# EAGLE design Shield H-Bridge v1.716 (EAGLE 7.2.0)
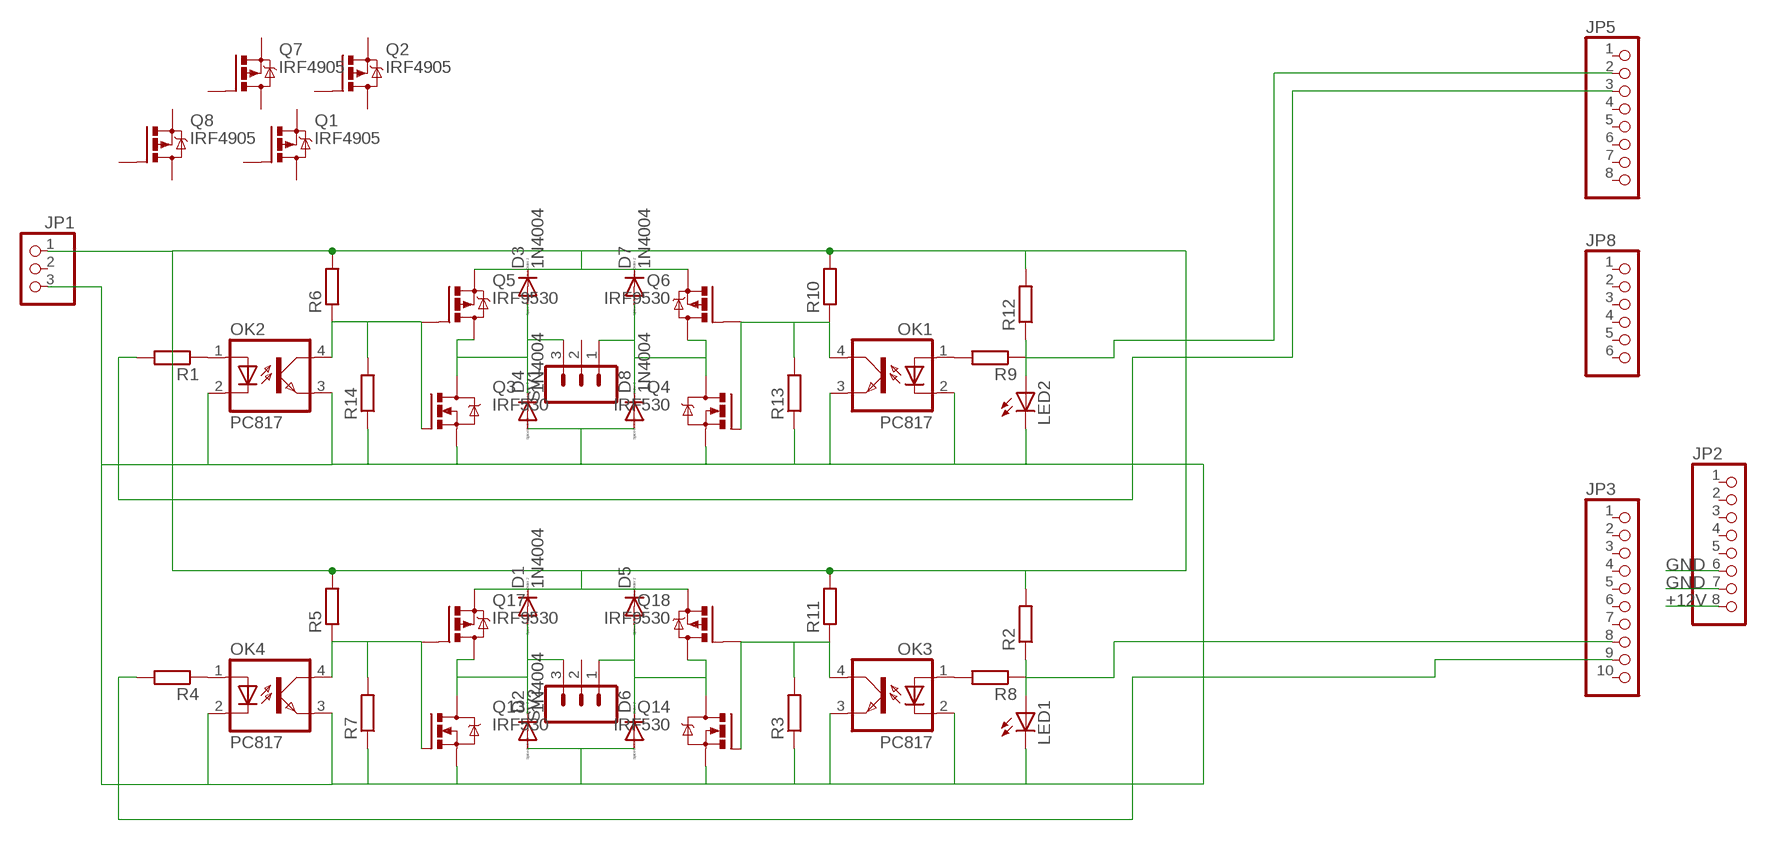
[diagram p0: schematic, sheet 1]

## Parts
D1  1N4004  [DO41-10]
D2  1N4004  [DO41-10]
D3  1N4004  [DO41-10]
D4  1N4004  [DO41-10]
D5  1N4004  [DO41-10]
D6  1N4004  [DO41-10]
D7  1N4004  [DO41-10]
D8  1N4004  [DO41-10]
JP1  PINHD-1X3  [1X03]
JP2  PINHD-1X8  [1X08]
JP3  PINHD-1X10  [1X10]
JP5  PINHD-1X8  [1X08]
JP8  PINHD-1X6  [1X06]
LED1  LED3MM  [LED3MM]
LED2  LED3MM  [LED3MM]
OK1  PC817  [DIL04]
OK2  PC817  [DIL04]
OK3  PC817  [DIL04]
OK4  PC817  [DIL04]
Q1  IRF4905  [TO220BH]
Q2  IRF4905  [TO220BH]
Q3  IRF530  [TO220BV]
Q4  IRF530  [TO220BV]
Q5  IRF9530  [TO220BV]
Q6  IRF9530  [TO220BV]
Q7  IRF4905  [TO220BH]
Q8  IRF4905  [TO220BH]
Q13  IRF530  [TO220BV]
Q14  IRF530  [TO220BV]
Q17  IRF9530  [TO220BV]
Q18  IRF9530  [TO220BV]
R1  R-EU_0204/7  [0204/7]
R2  R-EU_0204/5  [0204/5]
R3  R-EU_0204/7  [0204/7]
R4  R-EU_0204/7  [0204/7]
R5  R-EU_0204/7  [0204/7]
R6  R-EU_0204/7  [0204/7]
R7  R-EU_0204/7  [0204/7]
R8  R-EU_0204/7  [0204/7]
R9  R-EU_0204/7  [0204/7]
R10  R-EU_0204/7  [0204/7]
R11  R-EU_0204/7  [0204/7]
R12  R-EU_0204/5  [0204/5]
R13  R-EU_0204/7  [0204/7]
R14  R-EU_0204/7  [0204/7]
SV1  MA03-1  [MA03-1]
SV2  MA03-1  [MA03-1]

## Nets
+12V: D1.C D3.C D5.C D7.C JP1.1 JP2.8 Q5.S Q6.S Q17.S Q18.S R2.2 R5.2 R6.2 R10.2 R11.2 R12.2
GND: D2.A D4.A D6.A D8.A JP1.3 JP2.6 JP2.7 LED1.K(C) LED2.K(C) OK1.2(C) OK1.3(EMIT) OK2.2(C) OK2.3(EMIT) OK3.2(C) OK3.3(EMIT) OK4.2(C) OK4.3(EMIT) Q3.S Q4.S Q13.S Q14.S R3.1 R7.1 R13.1 R14.1
N$1: OK2.1(A) R1.1
N$2: OK4.1(A) R4.1
N$3: D7.A D8.C Q4.D Q6.D SV1.1
N$5: D3.A D4.C Q3.D Q5.D SV1.3
N$6: OK1.4(COL) Q4.G Q6.G R10.1 R13.2
N$7: D5.A D6.C Q14.D Q18.D SV2.1
N$8: D1.A D2.C Q13.D Q17.D SV2.3
N$9: LED1.A R2.1
N$10: OK3.1(A) R8.2
N$11: OK1.1(A) R9.2
N$12: OK3.4(COL) Q14.G Q18.G R3.2 R11.1
N$13: OK2.4(COL) Q3.G Q5.G R6.1 R14.2
N$14: LED2.A R12.1
N$18: OK4.4(COL) Q13.G Q17.G R5.1 R7.2
PWM1: JP3.8 R8.1
PWM1A: JP5.2 R9.1
PWM1B: JP5.3 R1.2
PWM2: JP3.9 R4.2
Unconnected: JP1.2 JP2.1 JP2.2 JP2.3 JP2.4 JP2.5 JP3.1 JP3.2 JP3.3 JP3.4 JP3.5 JP3.6 JP3.7 JP3.10 JP5.1 JP5.4 JP5.5 JP5.6 JP5.7 JP5.8 JP8.1 JP8.2 JP8.3 JP8.4 JP8.5 JP8.6 Q1.D Q1.G Q1.S Q2.D Q2.G Q2.S Q7.D Q7.G Q7.S Q8.D Q8.G Q8.S SV1.2 SV2.2

## Library data of the parts
D1-D8 = diode:1N4004: DIODE general purpose rectifier, 1 A
JP1 = pinhead:PINHD-1X3: PIN HEADER
JP2 JP5 = pinhead:PINHD-1X8: PIN HEADER
JP3 = pinhead:PINHD-1X10: PIN HEADER
JP8 = pinhead:PINHD-1X6: PIN HEADER
LED1 LED2 = led:LED: LED OSRAM: - CHIPLED LG R971, LG N971, LY N971, LG Q971, LY Q971, LO R971, LY R971 LH N974, LH R974 LS Q976, LO Q976, LY Q976 LO Q996 - Hyper CHIPLED LW Q18S LB Q993, LB Q99A, LB R99A - SideLED LS A670, LO A670, LY A670, LG A670, LP A670 LB A673, LV A673, LT A673, LW A673 LH A674 LY A675 LS A676, LA A676, LO A676, LY A676, LW A676 LS A679, LY A679, LG A679 - Hyper Micro SIDELED® LS Y876, LA Y876, LO Y876, LY Y876 LT Y87S - SmartLED LW L88C, LW L88S LB L89C, LB L89S, LG L890 LS L89K, LO L89K, LY L89K LS L896, LA L896, LO L896, LY L896 - TOPLED LS T670, LO T670, LY T670, LG T670, LP T670 LSG T670, LSP T670, LSY T670, LOP T670, LYG T670 LG T671, LOG T671, LSG T671 LB T673, LV T673, LT T673, LW T673 LH T674 LS T676, LA T676, LO T676, LY T676, LB T676, LH T676, LSB T676, LW T676 LB T67C, LV T67C, LT T67C, LS T67K, LO T67K, LY T67K, LW E67C LS E67B, LA E67B, LO E67B, LY E67B, LB E67C, LV E67C, LT E67C LW T67C LS T679, LY T679, LG T679 LS T770, LO T770, LY T770, LG T770, LP T770 LB T773, LV T773, LT T773, LW T773 LH T774 LS E675, LA E675, LY E675, LS T675 LS T776, LA T776, LO T776, LY T776, LB T776 LHGB T686 LT T68C, LB T68C - Hyper Mini TOPLED® LB M676 - Mini TOPLED Santana® LG M470 LS M47K, LO M47K, LY M47K Source: http://www.osram.convergy.de LUXEON: - LUMILED® LXK2-PW12-R00, LXK2-PW12-S00, LXK2-PW14-U00, LXK2-PW14-V00 LXK2-PM12-R00, LXK2-PM12-S00, LXK2-PM14-U00 LXK2-PE12-Q00, LXK2-PE12-R00, LXK2-PE12-S00, LXK2-PE14-T00, LXK2-PE14-U00 LXK2-PB12-K00, LXK2-PB12-L00, LXK2-PB12-M00, LXK2-PB14-N00, LXK2-PB14-P00, LXK2-PB14-Q00 LXK2-PR12-L00, LXK2-PR12-M00, LXK2-PR14-Q00, LXK2-PR14-R00 LXK2-PD12-Q00, LXK2-PD12-R00, LXK2-PD12-S00 LXK2-PH12-R00, LXK2-PH12-S00 LXK2-PL12-P00, LXK2-PL12-Q00, LXK2-PL12-R00 Source: www.luxeon.com KINGBRIGHT: KA-3528ASYC Source: www.kingbright.com
OK1-OK4 = optocoupler:PC817: SHARP OPTO COUPLER; MPN: PC817X4J000F; OC_FARNELL: 9707727; OC_NEWARK: 97K7059
Q1 Q2 Q7 Q8 = transistor-power:IRF4905: P-Channel HEXFET® Power MOSFET RDS(on)= 0.02 Ohm, ID = -74A Source: http://www.irf.com/product-info/datasheets/data/irf4905pbf.pdf
Q3 Q4 Q13 Q14 = transistor-power:IRF530: HEXFET Power MOSFET
Q5 Q6 Q17 Q18 = transistor-power:IRF9530: P-CHANNEL HEXFET POWER-MOS-FET Source: http://www.irf.com/product-info/datasheets/data/irf9530.pdf
R1-R14 = resistor:R-EU_: RESISTOR, European symbol
SV1 SV2 = con-lstb:MA03-1: PIN HEADER; OC_FARNELL: unknown; OC_NEWARK: unknown

## Board
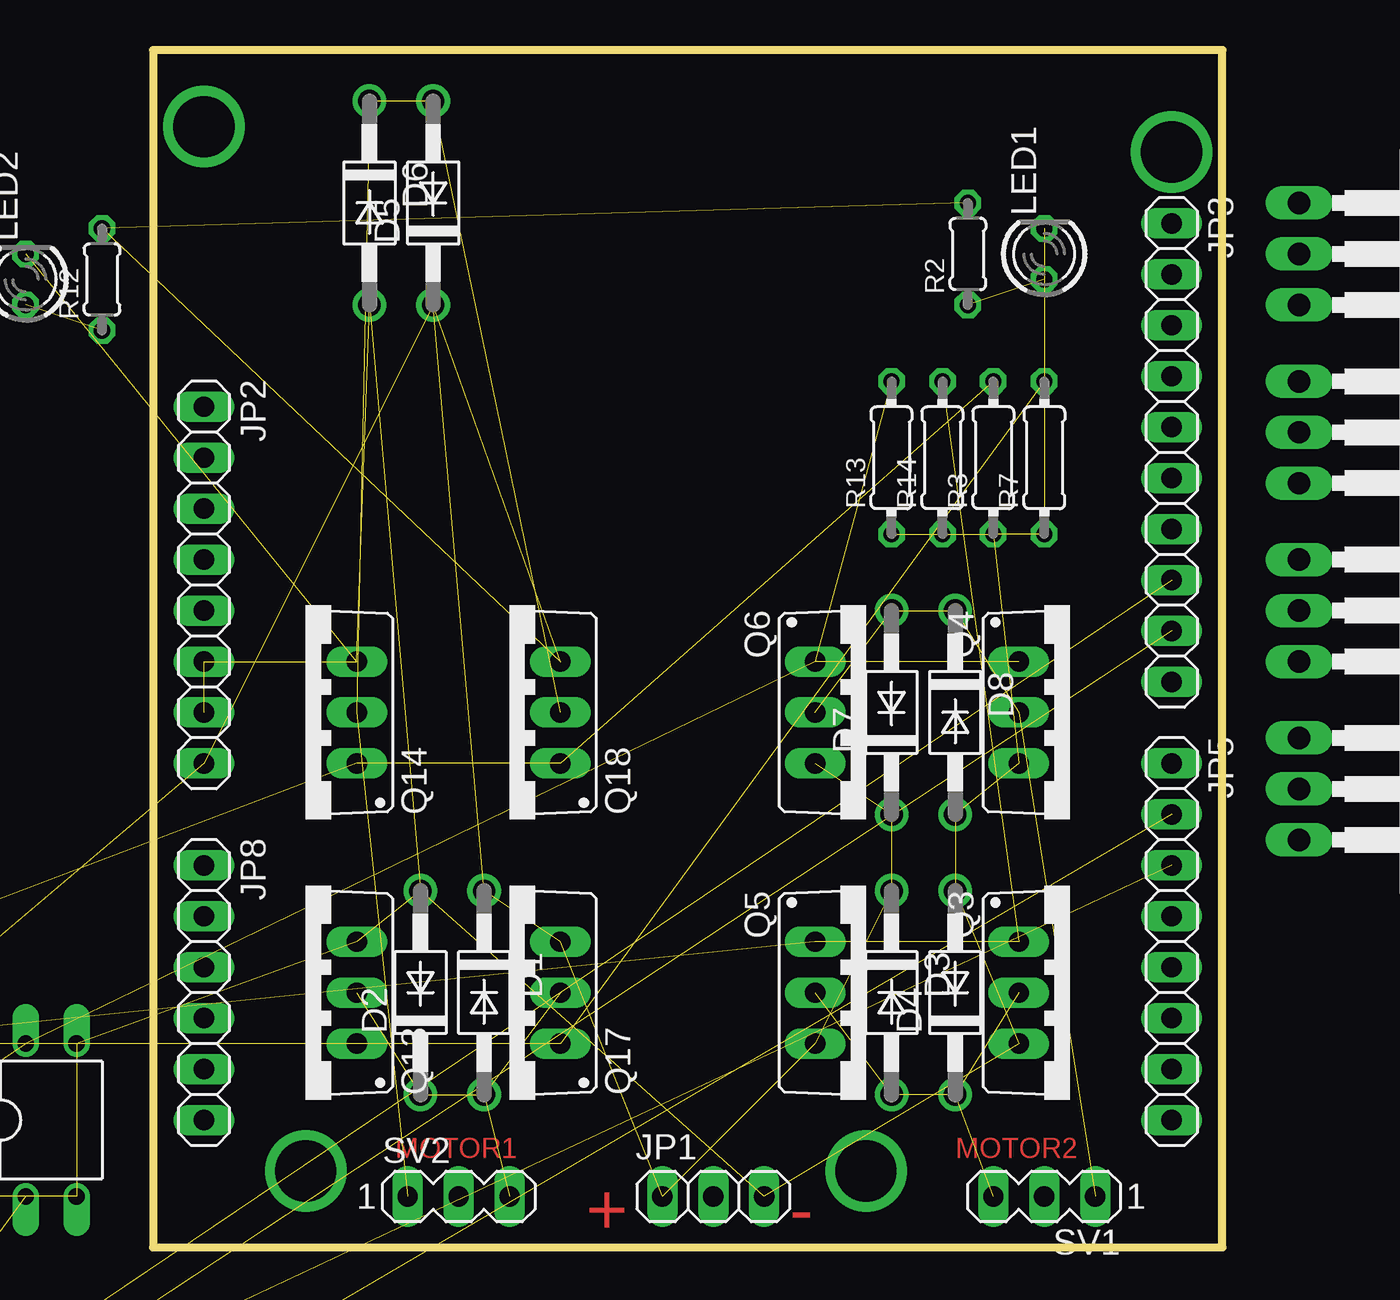
[diagram p1: board, top side]

Size 53.34 x 59.69 mm. Coordinates in mm from the lower left corner, seen from the top.
Outline: 53.34,59.69 0,59.69 0,0 53.34,0 53.34,59.69
Copper layers (1*16): Top 0.035mm / dielectric 1.5mm / Bottom 0.035mm
Design rules "default": minimum track width 10mil, minimum drill 24mil, track to track 8mil, track to pad 8mil, pad to pad 8mil, via to via 8mil, smd to smd 8mil, copper to edge 40mil, drill to drill 8mil, minimum pad ring 10mil, minimum via ring 8mil, stop-mask expansion 4mil, vias tented up to drill 0mil, thermal gap 10mil

### Footprints (pad centres in the part's own frame; a part is rotated, then mirrored left to right if it is on the bottom)
DO41-10 = drill 1.118: A 5.08,0; C -5.08,0
1X03 = drill 1.016 long: 1 -2.54,0; 2 0,0; 3 2.54,0
1X08 = drill 1.016 long: 1 -8.89,0; 2 -6.35,0; 3 -3.81,0; 4 -1.27,0; 5 1.27,0; 6 3.81,0; 7 6.35,0; 8 8.89,0
1X10 = drill 1.016 long: 1 -11.43,0; 2 -8.89,0; 3 -6.35,0; 4 -3.81,0; 5 -1.27,0; 6 1.27,0; 7 3.81,0; 8 6.35,0; 9 8.89,0; 10 11.43,0
1X06 = drill 1.016 long: 1 -6.35,0; 2 -3.81,0; 3 -1.27,0; 4 1.27,0; 5 3.81,0; 6 6.35,0
LED3MM = drill 0.813 octagon: A -1.27,0; K 1.27,0
DIL04 = drill 0.813 offset: 1 -1.27,-3.81; 2 1.27,-3.81; 3 1.27,3.81; 4 -1.27,3.81
TO220BH = drill 1.118 long: D 0,-6.35; G -2.54,-6.35; S 2.54,-6.35 | hole 3.302: 0,11.176
TO220BV = drill 1.016 long: D 0,-2.54; G -2.54,-2.54; S 2.54,-2.54
0204/7 = drill 0.813 octagon: 1 -3.81,0; 2 3.81,0
0204/5 = drill 0.813 octagon: 1 -2.54,0; 2 2.54,0
MA03-1 = drill 1.016 long: 1 -2.54,0; 2 0,0; 3 2.54,0

### Placement (x,y rotation side)
D1  16.51,12.7 270 top
D2  13.34,12.7 90 top
D3  36.83,12.7 270 top
D4  40.01,12.7 90 top
D5  13.97,52.07 90 top
D6  10.8,52.07 270 top
D7  36.83,26.67 90 top
D8  40.01,26.67 270 top
JP1  27.94,2.54 0 top
JP2  2.54,33.02 270 top
JP3  50.8,39.62 270 top
JP5  50.8,15.24 270 top
JP8  2.54,12.7 270 top
LED1  44.45,49.53 90 top
LED2  -6.35,48.26 90 top  (outside the outline)
OK1  -5.08,6.35 0 top  (outside the outline)
OK2  -15.24,6.35 0 top  (outside the outline)
OK3  -25.4,6.35 0 top  (outside the outline)
OK4  -35.56,6.35 0 top  (outside the outline)
Q1  63.5,40.64 270 top  (outside the outline)
Q2  63.5,22.86 270 top  (outside the outline)
Q3  45.72,12.7 270 top
Q4  45.72,26.67 270 top
Q5  35.56,12.7 270 top
Q6  35.56,26.67 270 top
Q7  63.5,49.53 270 top  (outside the outline)
Q8  63.5,31.75 270 top  (outside the outline)
Q13  7.62,12.7 90 top
Q14  7.62,26.67 90 top
Q17  17.78,12.7 90 top
Q18  17.78,26.67 90 top
R1  -34.29,-19.05 0 top  (outside the outline)
R2  40.64,49.53 90 top
R3  41.91,39.37 90 top
R4  -34.29,-22.86 0 top  (outside the outline)
R5  -34.29,-3.81 0 top  (outside the outline)
R6  -34.29,-7.62 0 top  (outside the outline)
R7  44.45,39.37 90 top
R8  -34.29,-26.67 0 top  (outside the outline)
R9  -34.29,-30.48 0 top  (outside the outline)
R10  -34.29,-11.43 0 top  (outside the outline)
R11  -34.29,-15.24 0 top  (outside the outline)
R12  -2.54,48.26 90 top
R13  36.83,39.37 90 top
R14  39.37,39.37 90 top
SV1  44.45,2.54 180 top
SV2  15.24,2.54 0 top

### Tracks (layer width: path | path; a pad name or v marks a point on that pad's centre or on a via)
+12V  (15 unrouted)
GND  (24 unrouted)
N$1  (1 unrouted)
N$2  (1 unrouted)
N$3  (4 unrouted)
N$5  (4 unrouted)
N$6  (4 unrouted)
N$7  (4 unrouted)
N$8  (4 unrouted)
N$9  (1 unrouted)
N$10  (1 unrouted)
N$11  (1 unrouted)
N$12  (4 unrouted)
N$13  (4 unrouted)
N$14  (1 unrouted)
N$16  (via drill 3.05 pad 4.06)
  other vias: 2.54,55.88
N$18  (4 unrouted)
N$19  (via drill 3.05 pad 4.06)
  other vias: 50.8,54.61
N$21  (via drill 3.05 pad 4.06)
  other vias: 7.62,3.81
N$23  (via drill 3.05 pad 4.06)
  other vias: 35.56,3.81
PWM1  (1 unrouted)
PWM1A  (1 unrouted)
PWM1B  (1 unrouted)
PWM2  (1 unrouted)

### Text on the board
Top: MOTOR1 | MOTOR2 | + | -